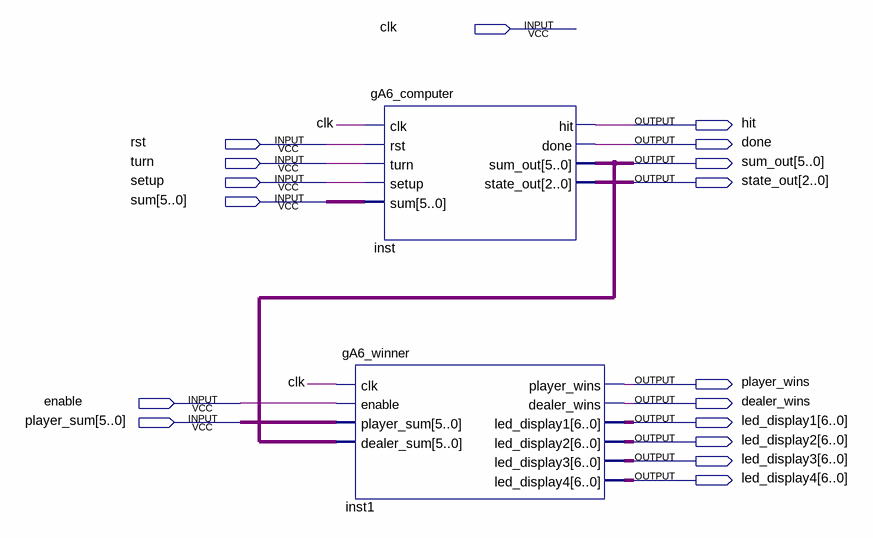
[diagram p0: schematic sheet]
// Quartus schematic Block2.bdf as structural Verilog: 2 symbols, 17 pins
module Block2 (
  input  clk,
  input  rst,
  input  turn,
  input  setup,
  input  [5:0] sum,
  input  enable,
  input  [5:0] player_sum,
  output hit,
  output done,
  output [5:0] sum_out,
  output [2:0] state_out,
  output player_wins,
  output dealer_wins,
  output [6:0] led_display1,
  output [6:0] led_display2,
  output [6:0] led_display3,
  output [6:0] led_display4
);

  gA6_winner inst1 (
    .clk(clk), .enable(enable), .player_sum(player_sum), .dealer_sum(sum_out), .player_wins(player_wins),
    .dealer_wins(dealer_wins), .led_display1(led_display1), .led_display2(led_display2),
    .led_display3(led_display3), .led_display4(led_display4));
  gA6_computer inst (
    .clk(clk), .rst(rst), .turn(turn), .setup(setup), .sum(sum), .hit(hit), .done(done), .sum_out(sum_out),
    .state_out(state_out));
endmodule
